# Altium project reles.PrjPcb
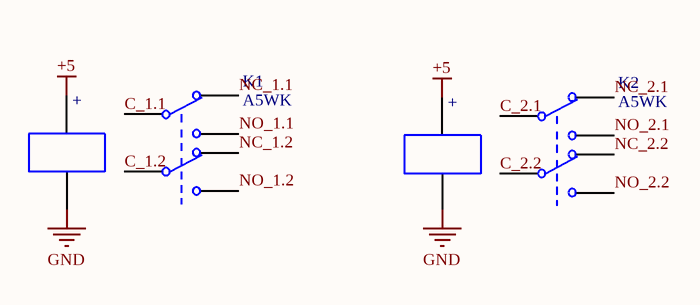
[diagram p0: takas.SchDoc]
1 sheet, 2 parts. Net scope: global (net labels, ports and power ports of the same name join across sheets).
Board file: takas.PcbDoc

## Sheet takas.SchDoc
size A4

### Parts
K1  ReleDPDT  [A5WK]  (value not drawn)
K2  ReleDPDT  [A5WK]  (value not drawn)

### Nets
+5: K1.1 K2.1
GND: K1.12
C_1.1: K1.9
C_1.2: K1.3
C_2.1: K2.9
C_2.2: K2.3
NC_1.1: K1.10
NC_1.2: K1.2
NC_2.1: K2.10
NC_2.2: K2.2
NO_1.1: K1.8
NO_1.2: K1.4
NO_2.1: K2.8
NO_2.2: K2.4

Not connected (* = marked no-connect by the designer): K2 12

### Notes on the sheet
- Labels drawn without touching a wire or pin: GND
- (in symbol 251) +

### Library data of the parts
K1 K2 = 251: Electromecánicos Relés  [A5WK / Fujitsu]; componente_asociado_id: 251; id: 8; codigo_ena: 5945003811; apto_para_cenelec: 0; modelo: A5WK; fabricante: Fujitsu; subtipo: Relés; obsoleto: 0